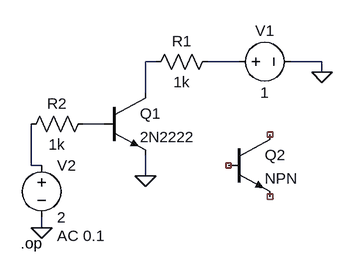
[diagram p0: schematic Draft3.asc]
Draft3.asc, the LTspice schematic file:
Version 4.1
SHEET 1 880 680
WIRE 144 96 128 96
WIRE 272 96 224 96
WIRE 400 96 352 96
WIRE 400 112 400 96
WIRE 128 144 128 96
WIRE 64 192 32 192
WIRE -48 256 -48 192
WIRE -32 256 -48 256
WIRE 128 272 128 240
WIRE -32 352 -32 336
FLAG 400 112 0
FLAG -32 352 0
FLAG 128 272 0
SYMBOL npn 64 144 R0
SYMATTR InstName Q1
SYMATTR Value 2N2222
SYMBOL voltage 256 96 R270
WINDOW 0 32 56 VTop 2
WINDOW 3 -32 56 VBottom 2
WINDOW 123 0 0 Left 0
WINDOW 39 0 0 Left 0
SYMATTR InstName V1
SYMATTR Value 1
SYMBOL res 240 80 R90
WINDOW 0 0 56 VBottom 2
WINDOW 3 32 56 VTop 2
SYMATTR InstName R1
SYMATTR Value 1k
SYMBOL voltage -32 240 R0
WINDOW 123 24 124 Left 2
WINDOW 39 0 0 Left 0
SYMATTR InstName V2
SYMATTR Value 2
SYMATTR Value2 AC 0.1
SYMBOL res 48 176 R90
WINDOW 0 0 56 VBottom 2
WINDOW 3 32 56 VTop 2
SYMATTR InstName R2
SYMATTR Value 1k
SYMBOL npn 256 208 R0
SYMATTR InstName Q2
TEXT -64 376 Left 2 !.op

The netlist it stands for:
* Draft3.asc
Q1 N001 N003 0 0 2N2222
V1 N002 0 1
R1 N002 N001 1k
V2 N004 0 2 AC 0.1
R2 N003 N004 1k
Q2 NC_01 NC_02 NC_03 0 NPN
.model NPN NPN
.model PNP PNP
.lib standard.bjt
.op
.backanno
.end